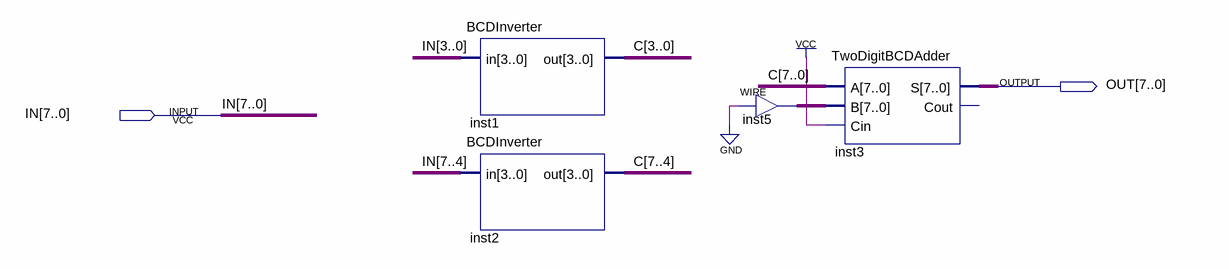
[diagram p0: schematic sheet]
// Quartus schematic TwoDigitBCDInverter.bdf as structural Verilog: 4 symbols, 2 pins
module TwoDigitBCDInverter (
  input  [7:0] IN,
  output [7:0] OUT
);

  wire [7:0] C, inst5_out;

  BCDInverter inst1 (.in(IN[3:0]), .out(C[3:0]));
  BCDInverter inst2 (.in(IN[7:4]), .out(C[7:4]));
  assign inst5_out = {8{1'b0}};  // WIRE inst5
  TwoDigitBCDAdder inst3 (.A(C), .B(inst5_out), .Cin(1'b1), .S(OUT));  // open: Cout
endmodule
